# EasyEDA schematic 1-Schematic_Inverter.json
TITLE: Sheet_1; REV: 1.0; Date: 2022-04-22; Sheet: 1/1; Drawn By: Ammar Alqrni; Company: Your Company
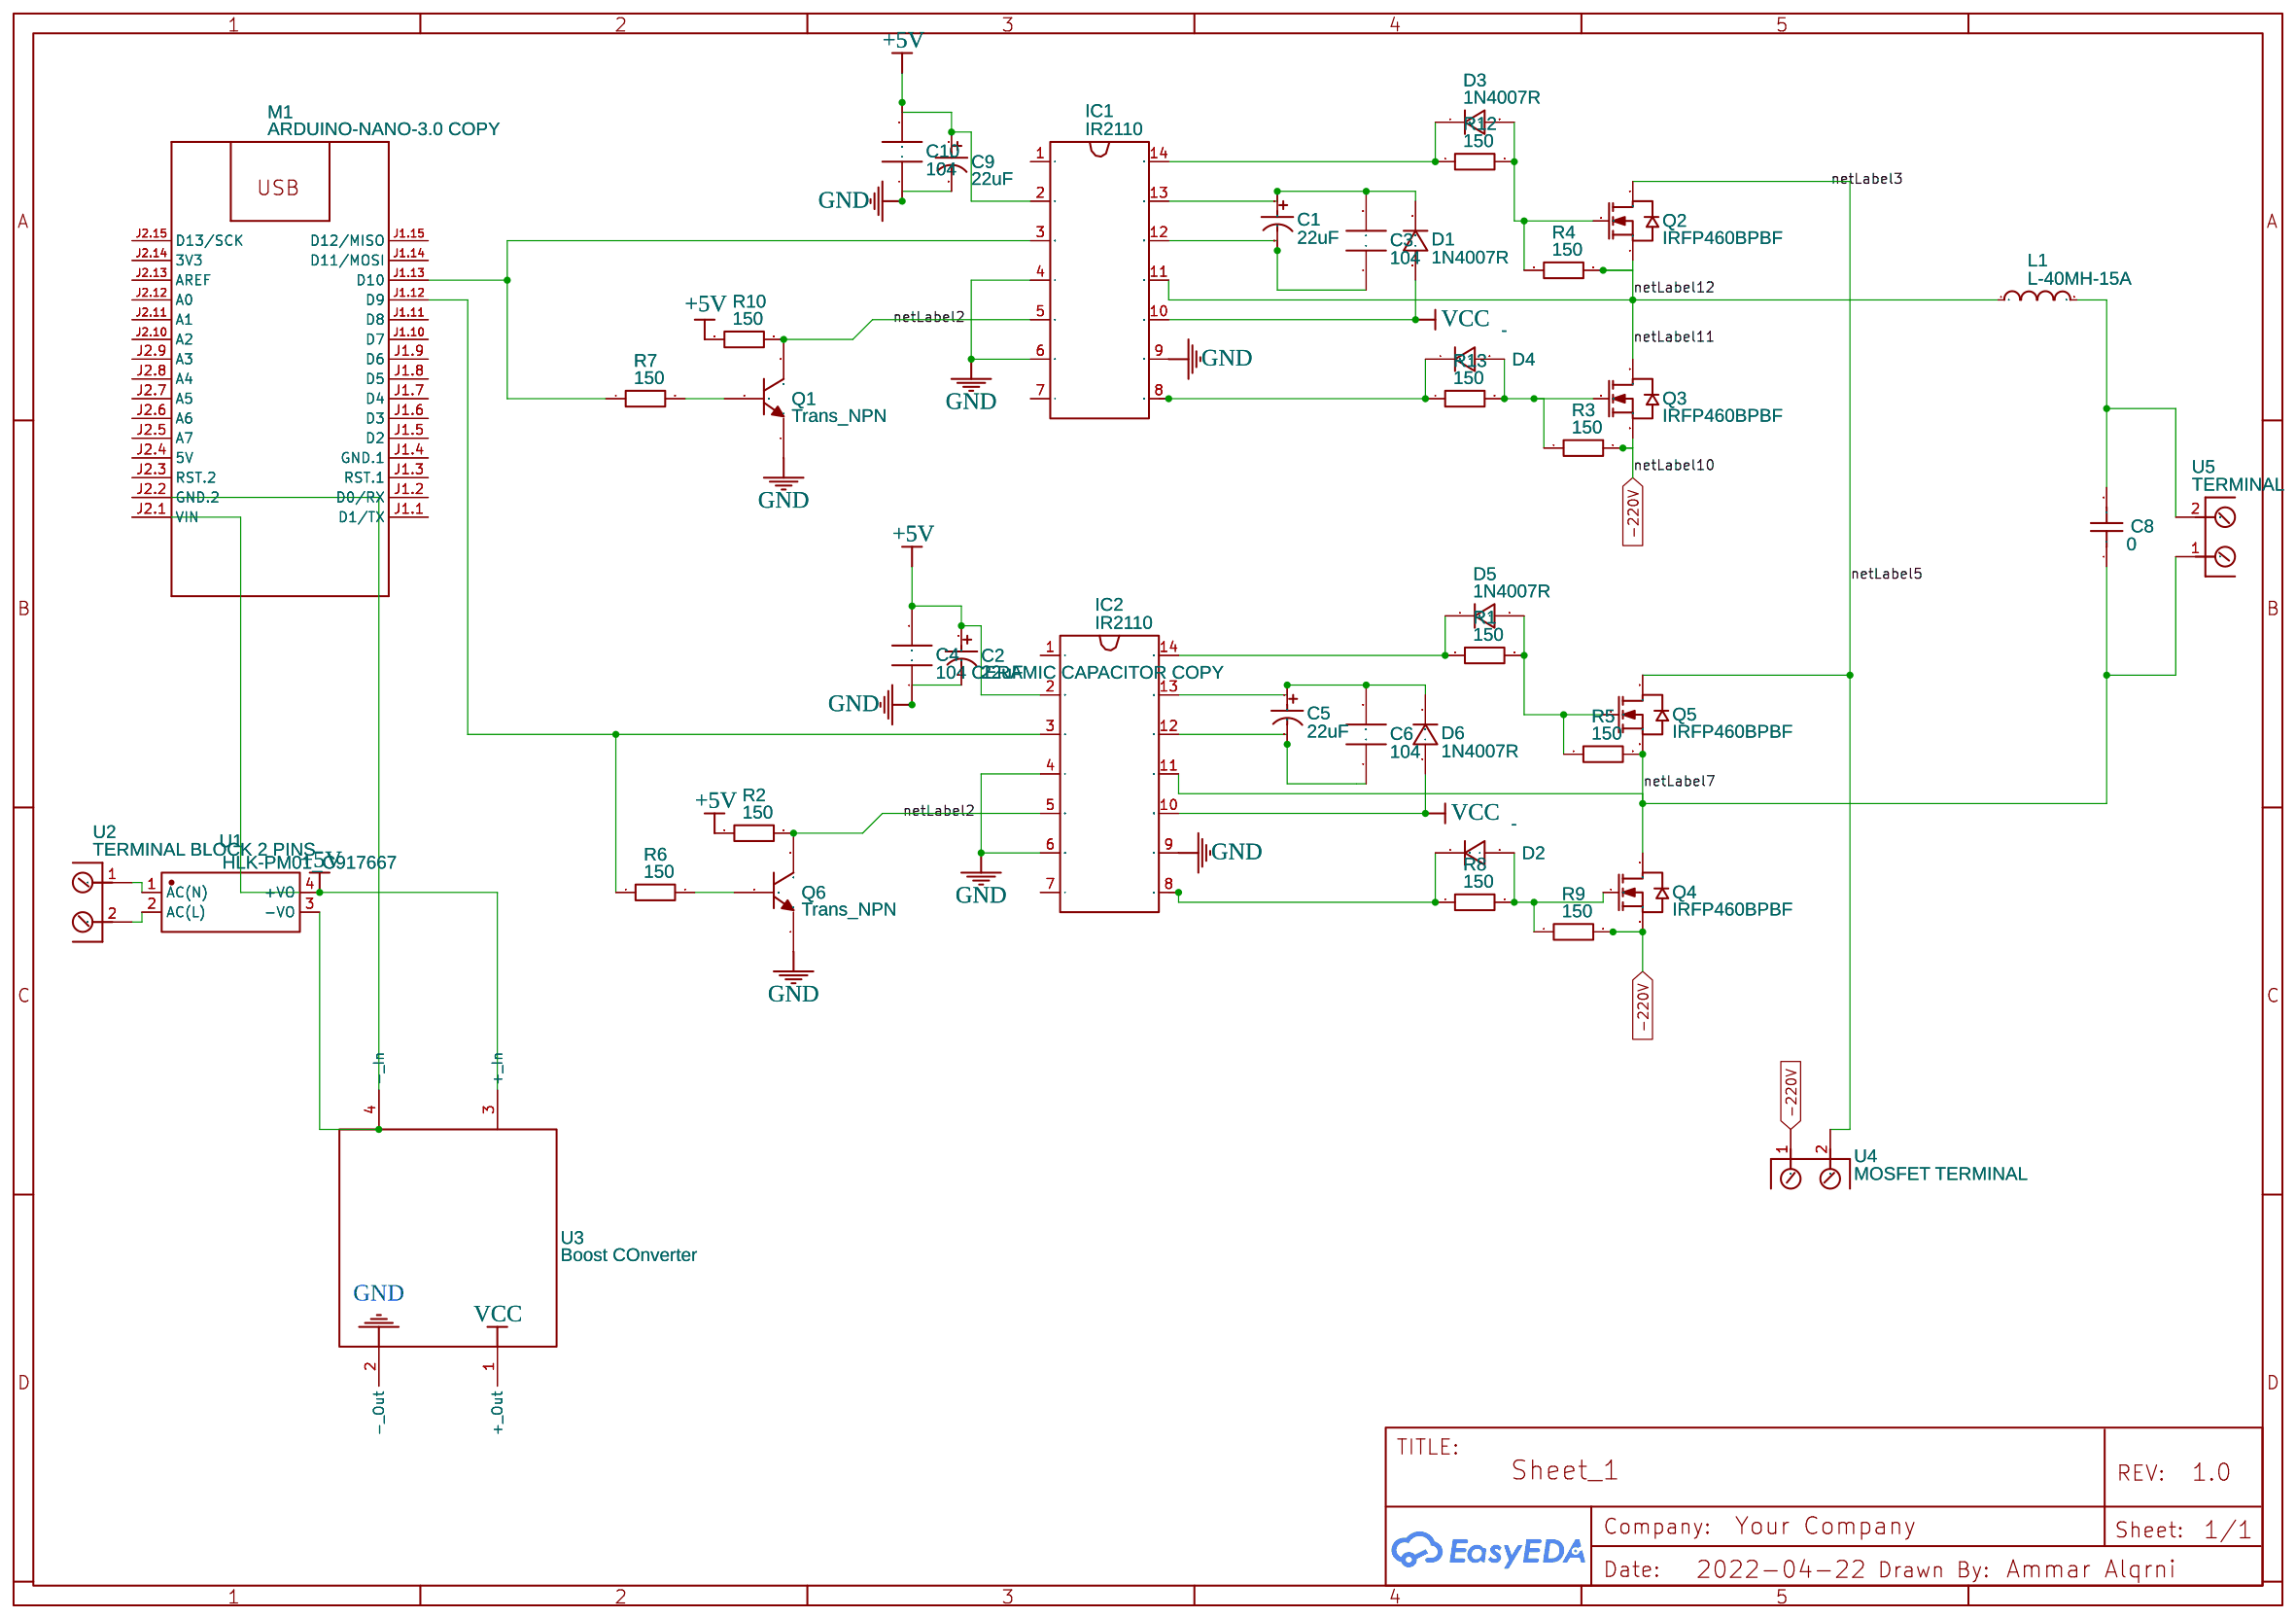
[diagram p0: schematic sheet]

## Parts
C1  22uF  [EL. CAP. 22UF 50V]
C2  22uF  [EL. CAP. 22UF 50V]
C3  104  [104 CAPACITOR]
C4  104 CERAMIC CAPACITOR COPY  [104 CAPACITOR]
C5  22uF  [EL. CAP. 22UF 50V]
C6  104  [104 CAPACITOR]
C8  0  [CBB22-225J400V]
C9  22uF  [EL. CAP. 22UF 50V]
C10  104  [104 CAPACITOR]
D1  1N4007R  [DO-41_BD2.4-L4.7-P8.70-D0.9-RD]
D2  -  [DO-41_BD2.4-L4.7-P8.70-D0.9-RD]
D3  1N4007R  [DO-41_BD2.4-L4.7-P8.70-D0.9-RD]
D4  -  [DO-41_BD2.4-L4.7-P8.70-D0.9-RD]
D5  1N4007R  [DO-41_BD2.4-L4.7-P8.70-D0.9-RD]
D6  1N4007R  [DO-41_BD2.4-L4.7-P8.70-D0.9-RD]
IC1  IR2110  [IR2110]
IC2  IR2110  [IR2110]
L1  L-40MH-15A  [TANGDA-40MH]
M1  ARDUINO-NANO-3.0 COPY  [ARDUINO-NANO-3.0]
Q1  Trans_NPN  [NPN]
Q2  IRFP460BPBF  [TO-247AC-3_L15.8-W5.0-P5.46-L]
Q3  IRFP460BPBF  [TO-247AC-3_L15.8-W5.0-P5.46-L]
Q4  IRFP460BPBF  [TO-247AC-3_L15.8-W5.0-P5.46-L]
Q5  IRFP460BPBF  [TO-247AC-3_L15.8-W5.0-P5.46-L]
Q6  Trans_NPN  [NPN]
R1  150  [RESISTOR 1/4 WATT 150 OHM]
R2  150  [RESISTOR 1/4 WATT 150 OHM]
R3  150  [RESISTOR 1/4 WATT 150 OHM]
R4  150  [RESISTOR 1/4 WATT 150 OHM]
R5  150  [RESISTOR 1/4 WATT 150 OHM]
R6  150  [RESISTOR 1/4 WATT 150 OHM]
R7  150  [RESISTOR 1/4 WATT 150 OHM]
R8  150  [RESISTOR 1/4 WATT 150 OHM]
R9  150  [RESISTOR 1/4 WATT 150 OHM]
R10  150  [RESISTOR 1/4 WATT 150 OHM]
R12  150  [RESISTOR 1/4 WATT 150 OHM]
R13  150  [RESISTOR 1/4 WATT 150 OHM]
U1  HLK-PM01_C917667  [PWRM-TH_HLK-PM01_C917667]
U2  TERMINAL BLOCK 2 PINS  [5A_2PIN-TERMINALBLOCK]
U3  Boost COnverter  [BOOST CONVERTER]
U4  MOSFET TERMINAL  [5A_2PIN-TERMINALBLOCK]
U5  TERMINAL  [5A_2PIN-TERMINALBLOCK]

## Library data of the parts
C1 C2 C5 C9 = 22uF: Voltage: 50V; Supplier Part: C28057; Supplier: LCSC; Manufacturer: ValuePro; Manufacturer Part: 22UF 50V
C3 C4 C6 C10 = 104 CERAMIC CAPACITOR COPY: Contributor: spacezhang
C8 = CBB22-225J400V: Supplier Part: C44081; Supplier: LCSC; Manufacturer: LCSC; Manufacturer Part: CBB22474J630V; Contributor: LCSC
D1-D6 = 1N4007R: Supplier: LCSC; Supplier Part: C432606; Manufacturer: Chongqing Pingwei Tech; Contributor: LCSC; JLCPCB Part Class: Extended Part
IC1 IC2 = IR2110: Contributor: SIIISSIIIS
L1 = L-40MH-15A: Manufacturer: ReliaPro; Manufacturer Part: General Inductor(TH)/10uH电感
M1 = ARDUINO-NANO-3.0 COPY: Contributor: 01Test001
Q1 Q6 = Trans_NPN: NPN General Purpose Amplifier
Q2-Q5 = IRFP460BPBF: Supplier: LCSC; Supplier Part: C428743; Manufacturer: Vishay Intertech; Contributor: LCSC; JLCPCB Part Class: Extended Part
R1-R10 R12 R13 = 150: Contributor: Hendriyana
U1 = HLK-PM01_C917667: Supplier: LCSC; Supplier Part: C917667; Manufacturer: TESL*A; Manufacturer Part: HLK-PM01; Contributor: LCSC; JLCPCB Part Class: Extended Part
U2 U4 U5 = TERMINAL BLOCK 2 PINS: Contributor: Christel_Peeris
U3 = Boost COnverter: Contributor: sunb

## Nets
+5V: C2.1 C4.2 C9.1 C10.2 IC1.2 IC2.2 R2.1 R10.1 U1.4(+VO) U3.3(+ In)
-220V: Q3.3(S) Q4.3(S) R3.2 R9.2 U4.1
GND: C2.2 C4.1 C9.2 C10.1 IC1.4 IC1.6 IC1.9 IC2.4 IC2.6 IC2.9 Q1.1(E) Q6.1(E) U3.2(- Out)
VCC: D1.2(A) D6.2(A) IC1.10 IC2.10 U3.1(+ Out)
netLabel2: IC1.5 IC2.5 Q1.3(C) Q6.3(C) R2.2 R10.2
netLabel3: Q2.2(D) Q5.2(D) U4.2
netLabel7: C8.1 IC2.11 Q4.2(D) Q5.3(S) R5.2 U5.1
netLabel11: IC1.11 L1.1 Q2.3(S) Q3.2(D) R4.2
Net-(C1-1): C1.1 C3.2 D1.1(C) IC1.13
Net-(C1-2): C1.2 C3.1 IC1.12
Net-(C5-1): C5.1 C6.2 D6.1(C) IC2.13
Net-(C5-2): C5.2 C6.1 IC2.12
Net-(C8-2): C8.2 L1.2 U5.2
Net-(D2-1): D2.1(C) IC2.8 R8.1
Net-(D2-2): D2.2(A) Q4.1(G) R8.2 R9.1
Net-(D3-1): D3.1(C) IC1.14 R12.1
Net-(D3-2): D3.2(A) Q2.1(G) R4.1 R12.2
Net-(D4-1): D4.1(C) IC1.8 R13.1
Net-(D4-2): D4.2(A) Q3.1(G) R3.1 R13.2
Net-(D5-1): D5.1(C) IC2.14 R1.1
Net-(D5-2): D5.2(A) Q5.1(G) R1.2 R5.1
Net-(IC1-3): IC1.3 M1.J1.13(D10) R7.1
Net-(IC2-3): IC2.3 M1.J1.12(D9) R6.1
Net-(M1-J2.2): M1.J2.2(GND.2) U1.3(-VO) U3.4(- In)
Net-(Q1-2): Q1.2(B) R7.2
Net-(Q6-2): Q6.2(B) R6.2
Net-(U1-1): U1.1(AC(N)) U2.1
Net-(U1-2): U1.2(AC(L)) U2.2

Not connected (* = marked no-connect by the designer): IC1 1 7; IC2 1 7; M1 J1.1(D1/TX) J1.2(D0/RX) J1.3(RST.1) J1.4(GND.1) J1.5(D2) J1.6(D3) J1.7(D4) J1.8(D5) J1.9(D6) J1.10(D7) J1.11(D8) J1.14(D11/MOSI) J1.15(D12/MISO) J2.1(VIN) J2.3(RST.2) J2.4(5V) J2.5(A7) J2.6(A6) J2.7(A5) J2.8(A4) J2.9(A3) J2.10(A2) J2.11(A1) J2.12(A0) J2.13(AREF) J2.14(3V3) J2.15(D13/SCK)
